# EAGLE schematic test4 (EAGLE 9.5.1)
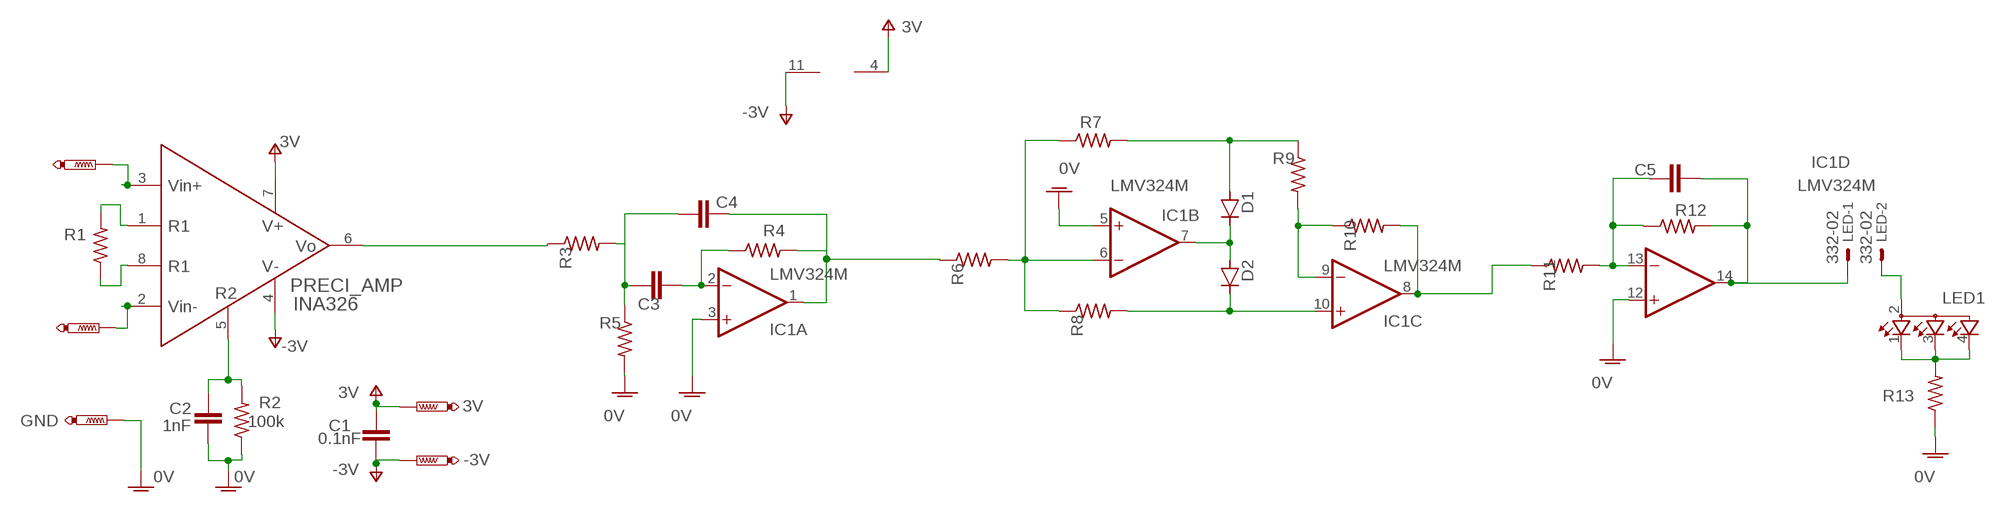
[diagram p0: schematic, sheet 1]

## Parts
3V  PTR1PAD1-13  [P1-13]
-3V  PTR1PAD1-13  [P1-13]
C1  0.1nF  C-EUC0603  [C0603]
C2  1nF  C-EUC0603  [C0603]
C3  0.1nF  C-EUC0603  [C0603]
C4  0.1nF  C-EUC0603  [C0603]
C5  0.1nF  C-EUC0603  [C0603]
D1  D-SOD-80  [SOD80]
D2  D-SOD-80  [SOD80]
GND  PTR1PAD1-13  [P1-13]
IC1  LMV324M  [SO14]
IN+  PTR1PAD1-13  [P1-13]
IN-  PTR1PAD1-13  [P1-13]
LED  332-02  [332-02]
LED1  TOPLED-3  [P-LCC-4-3]
PRECI_AMP  INA326  INA326EA/250  [SOP65P490X110-8N]
R1  100k  R-US_R0603  [R0603]
R2  100k  R-US_R0603  [R0603]
R3  100k  R-US_R0603  [R0603]
R4  100k  R-US_R0603  [R0603]
R5  100k  R-US_R0603  [R0603]
R6  100k  R-US_R0603  [R0603]
R7  100k  R-US_R0603  [R0603]
R8  100k  R-US_R0603  [R0603]
R9  100k  R-US_R0603  [R0603]
R10  100k  R-US_R0603  [R0603]
R11  100k  R-US_R0603  [R0603]
R12  100k  R-US_R0603  [R0603]
R13  100k  R-US_R0603  [R0603]

## Nets
GNDA: C2.1 GND.TP IC1.3(A:+IN) IC1.5(B:+IN) IC1.12(D:+IN) R2.1 R5.2 R13.1 ; supply symbol labelled 0V
N$1: PRECI_AMP.1(R1_2) R1.2
N$2: PRECI_AMP.8(R1) R1.1
N$3: IN+.TP PRECI_AMP.3(VIN+)
N$4: C2.2 PRECI_AMP.5(R2) R2.2
N$5: IN-.TP PRECI_AMP.2(VIN-)
N$6: C3.1 IC1.2(A:-IN) R4.1
N$7: C3.2 C4.2 R3.2 R5.1
N$8: C5.1 IC1.13(D:-IN) R11.2 R12.1
N$9: PRECI_AMP.6(VO) R3.1
N$10: IC1.6(B:-IN) R6.2 R7.1 R8.1
N$11: D2.1(C) IC1.10(C:+IN) R8.2
N$12: IC1.9(C:-IN) R9.2 R10.1
N$13: D1.1(C) D2.2(A) IC1.7(B:OUT)
N$14: D1.2(A) R7.2 R9.1
N$15: IC1.8(C:OUT) R10.2 R11.1
N$16: C5.2 IC1.14(D:OUT) LED.1 R12.2
N$17: LED1.1(CRED) LED1.3(CBLUE) LED1.4(CGREEN) R13.2
N$20: LED1.2(A2) LED.2
N$23: C4.1 IC1.1(A:OUT) R4.2 R6.1
V+: 3V.TP C1.1 IC1.4(P:V+) PRECI_AMP.7(V+) ; supply symbol labelled 3V
V-: -3V.TP C1.2 IC1.11(P:V-) PRECI_AMP.4(V-) ; supply symbol labelled -3V

## Library data of the parts
3V -3V GND IN+ IN- = testpad:PTR1: TEST PIN
C1-C5 = rcl:C-EU: CAPACITOR, European symbol; SPICEPREFIX: C
D1 D2 = semicon-smd-ipc:D-: DIODE unfilled
IC1 = linear:LMV324?*: Quad General Purpose, Low Voltage, Rail-to-Rail Output Operational Amplifiers Source: http://www.national.com/mpf/LM/LMV321.html http://www.national.com/dt/lmv_qual.pdf; SPICEPREFIX: J
LED = con-garry:332-02: 2 Pin - 2mm Dual Row Source: www.mpe-connector.de / garry_shortform_2012.pdf
LED1 = led:TOPLED-3: OSRAM - Hyper Multi TOPLED® (RGB) LB E673, LV E673, LT E673 - Power TOPLED® Enhanced optical Power LED (HOP2000) LS E67B, LA E67B, LO E67B, LY E67B - Hyper Multi TOPLED® Enhanced optical Power LED (HOP2000 / ATON®) LATB T66B - Hyper Multi TOPLED® Hyper-Bright LED LATB T686 Source: http://www.osram.convergy.de/
PRECI_AMP = INA326EA_250:INA326EA/250: Precision, Rail-to-Rail I/O INSTRUMENTATION AMPLIFIER; DESCRIPTION: Precision, Low Drift, CMOS Instrumentation Amplifier 8-VSSOP -40 to 85; DIGI-KEY_PART_NUMBER: 296-15312-1-ND; DIGI-KEY_PURCHASE_URL: https://www.digikey.com/product-detail/en/texas-instruments/INA326EA-250/296-15312-1-ND/568254?utm_source=snapeda&utm_medium=aggregator&utm_campaign=symbol; MF: Texas Instruments; MP: INA326; PACKAGE: MSOP-8 Texas Instruments
R1-R13 = rcl:R-US_: RESISTOR, American symbol; SPICEPREFIX: R